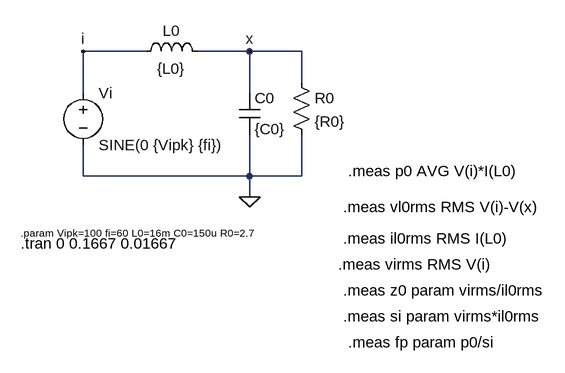
[diagram p0: schematic RLC.asc]
RLC.asc, the LTspice schematic file:
Version 4
SHEET 1 880 680
WIRE 32 48 -64 48
WIRE 192 48 112 48
WIRE 272 48 192 48
WIRE 272 96 272 48
WIRE -64 112 -64 48
WIRE 192 112 192 48
WIRE -64 240 -64 192
WIRE 192 240 192 176
WIRE 192 240 -64 240
WIRE 272 240 272 176
WIRE 272 240 192 240
WIRE 192 272 192 240
FLAG 192 272 0
FLAG -64 48 i
FLAG 192 48 x
SYMBOL cap 176 112 R0
SYMATTR InstName C0
SYMATTR Value {C0}
SYMBOL res 256 80 R0
SYMATTR InstName R0
SYMATTR Value {R0}
SYMBOL ind 16 64 R270
WINDOW 0 32 56 VTop 2
WINDOW 3 5 56 VBottom 2
SYMATTR InstName L0
SYMATTR Value {L0}
SYMBOL voltage -64 96 R0
WINDOW 123 0 0 Left 0
WINDOW 39 0 0 Left 0
SYMATTR InstName Vi
SYMATTR Value SINE(0 {Vipk} {fi})
TEXT -160 328 Left 1 !.param Vipk=100 fi=60 L0=16m C0=150u R0=2.7
TEXT -160 344 Left 2 !.tran 0 0.1667 0.01667
TEXT 336 288 Left 2 !.meas vl0rms RMS V(i)-V(x)
TEXT 336 336 Left 2 !.meas il0rms RMS I(L0)
TEXT 328 376 Left 2 !.meas virms RMS V(i)
TEXT 336 416 Left 2 !.meas z0 param virms/il0rms
TEXT 344 232 Left 2 !.meas p0 AVG V(i)*I(L0)
TEXT 336 456 Left 2 !.meas si param virms*il0rms
TEXT 344 496 Left 2 !.meas fp param p0/si

The netlist it stands for:
* RLC.asc
C0 x 0 {C0}
R0 x 0 {R0}
L0 i x {L0}
Vi i 0 SINE(0 {Vipk} {fi})
.param Vipk=100 fi=60 L0=16m C0=150u R0=2.7
.tran 0 0.1667 0.01667
.meas vl0rms RMS V(i)-V(x)
.meas il0rms RMS I(L0)
.meas virms RMS V(i)
.meas z0 param virms/il0rms
.meas p0 AVG V(i)*I(L0)
.meas si param virms*il0rms
.meas fp param p0/si
.backanno
.end